# EasyEDA Pro project 嘉立创EDAPRO_A4矮轴_v1.0.0.epro

# Board 20260607开源
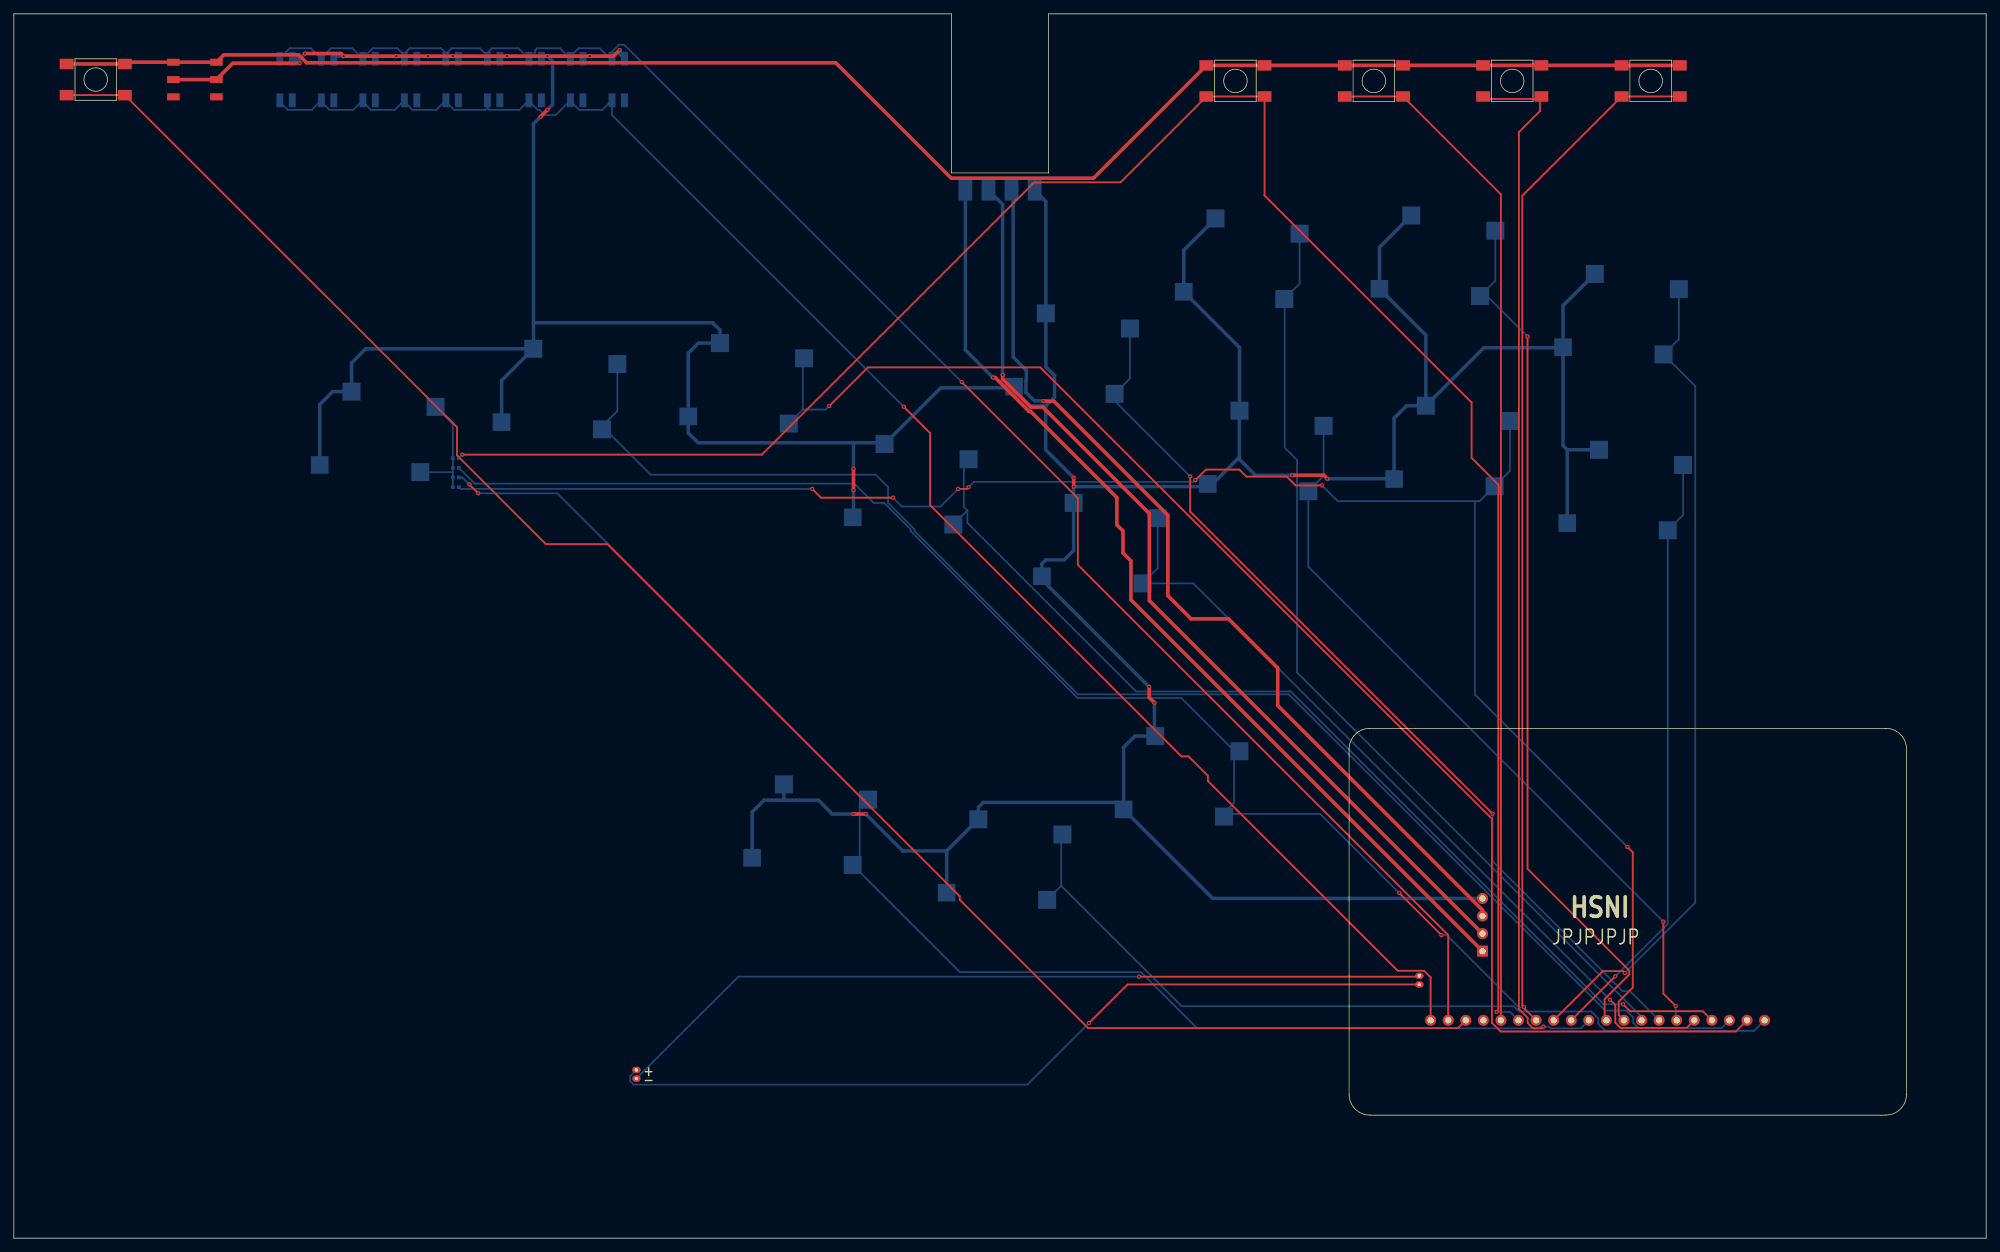
[diagram p0: board, top side]
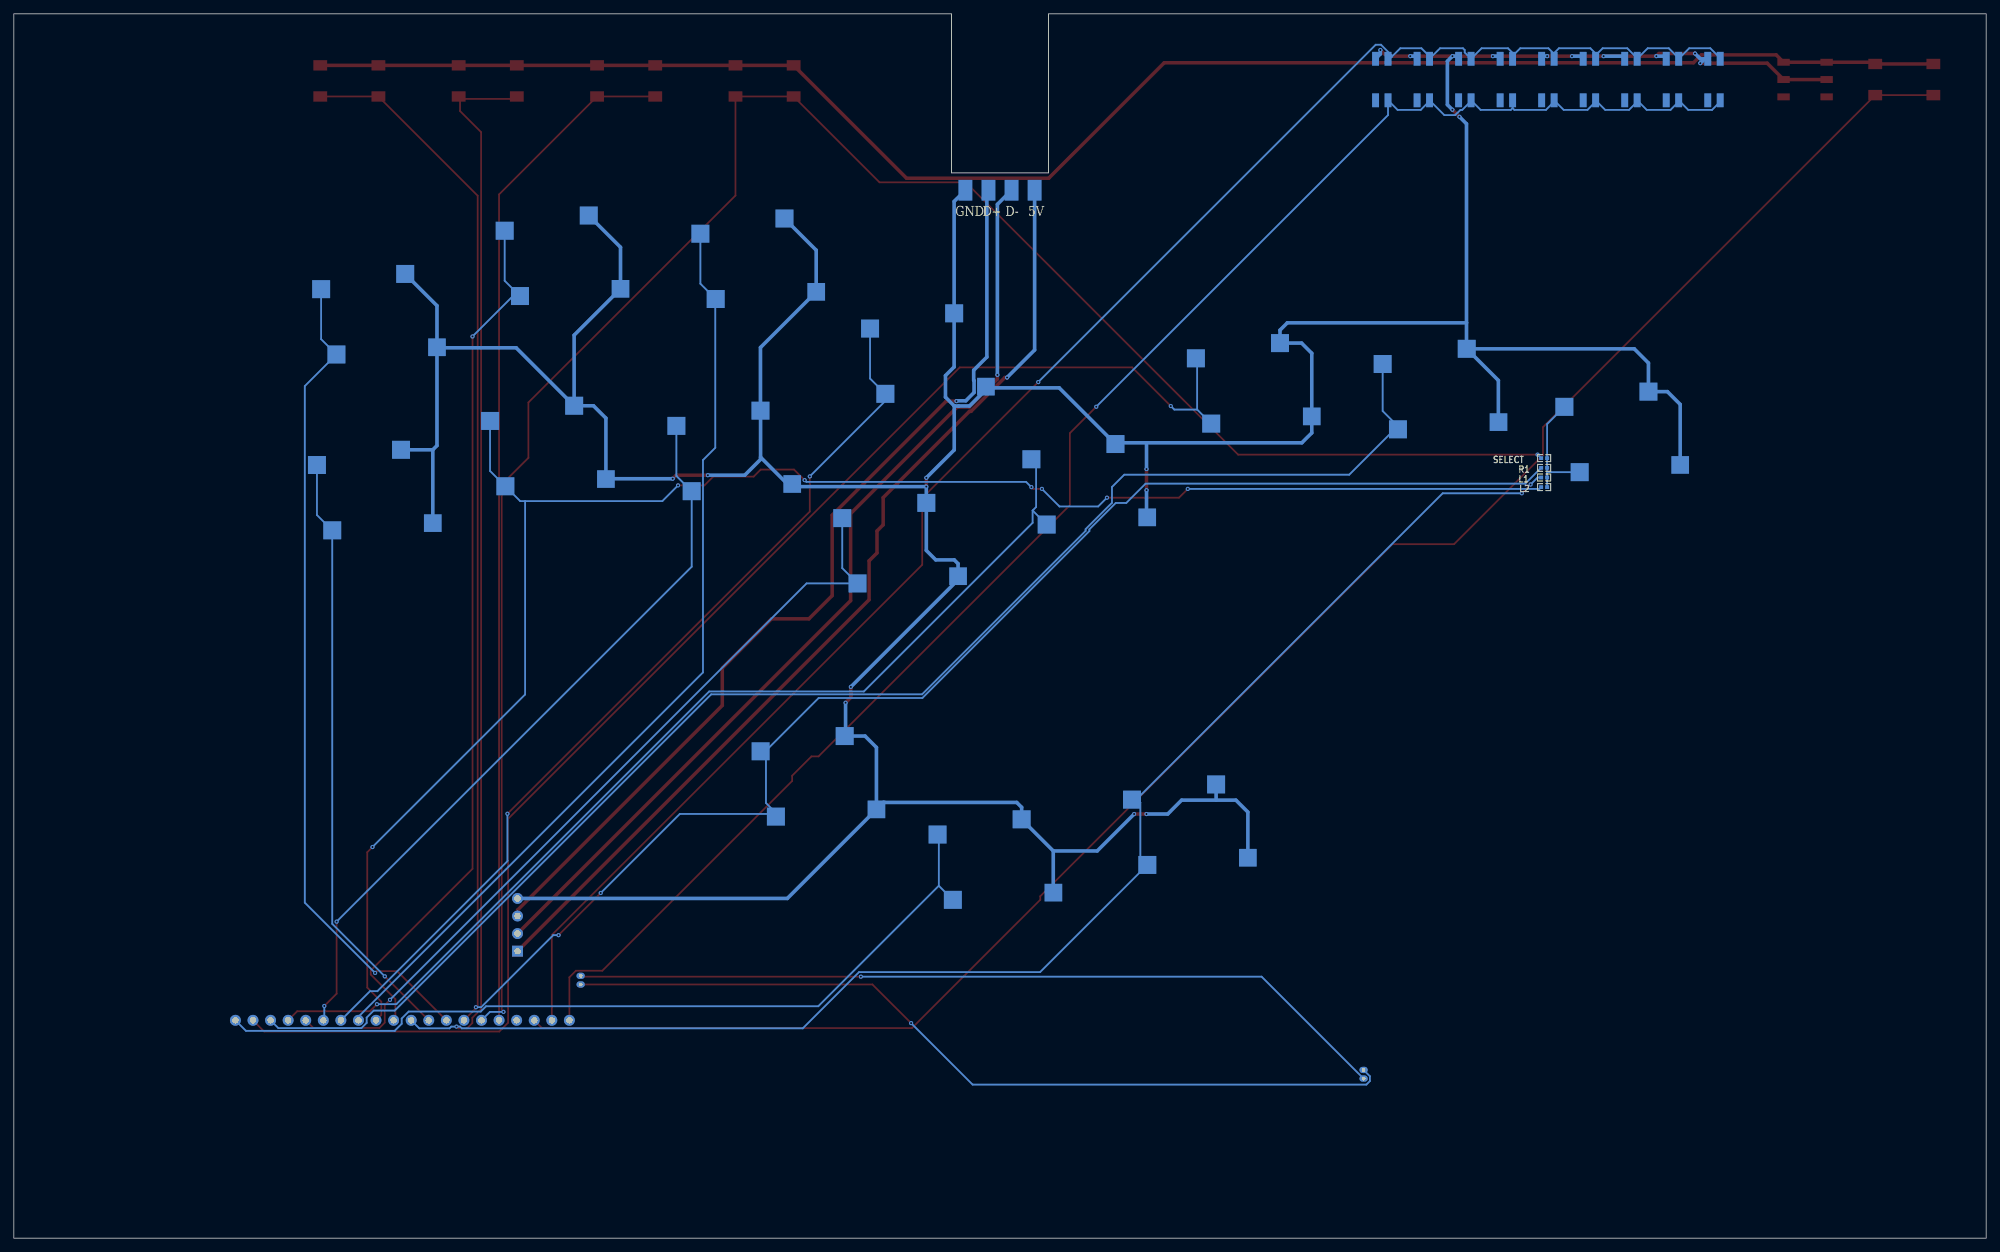
[diagram p1: board, bottom side, seen from below]

Outline 285 x 177 mm; copper layers: Top Layer, Bottom Layer. Coordinates in mm from the lower left corner of the outline.
Outline path: 0,177 135.5,177 135.5,154 149.5,154 149.5,177 285,177 285,0 0,0 0,177
Stack: Top Layer 0.035mm / Dielectric1 1.51mm FR4 er 4.5 / Bottom Layer 0.035mm

## Design rules (mm)
spacing copperThickness1oz (default): track to track 0.102, other pairs 0.152 to 0.3
spacing copperThickness2oz: track to track 0.203, other pairs 0.152 to 0.3
track width copperThickness1oz (default): min 0.127, default 0.254, max 2.54
track width copperThickness2oz: min 0.203, default 0.254, max 2.54
differential pair differentialPair (default): width min 0.127, default 0.254, max 2.54; gap min 0.152, default 0.152

## Placement (name value [footprint] x y rotation side)
L1  10K  [R0402]  63.87 109.97 180 bottom
L2  10K  [R0402]  63.87 108.57 180 bottom
NOREF  -  [Pad_e911]  189.26 117.43 0 top
NOREF#2  -  [Pad_e515]  29.27 167.5 0 top
NOREF#3  -  [Pad_e773]  212.22 46.57 270 top
NOREF#4  -  [Pad_e811]  58.23 164.5 180 top
NOREF#5  -  [Pad_e777]  217.42 31.5 0 top
NOREF#6  -  [Pad_e531]  121.23 104.21 180 top
NOREF#7  -  [Pad_e697]  149.31 48.91 180 top
NOREF#8  -  [Pad_e550]  164.94 72.59 0 top
NOREF#9  -  [Pad_e9]  220.72 165.05 0 top
NOREF#10  -  [Pad_e5]  220.72 169.55 0 top
NOREF#11  -  [Pad_e530]  102.04 129.4 0 top
NOREF#12  -  [Pad_e560]  16.03 165.25 0 top
NOREF#13  -  [Pad_e546]  204.04 120.34 0 top
NOREF#14  -  [Pad_e524]  88.23 170.5 180 top
NOREF#15  -  [Pad_e716]  214.08 145.64 0 top
NOREF#16  -  [Pad_e803]  44.43 170.5 180 top
NOREF#17  -  [Pad_e527]  70.47 117.97 180 top
NOREF#18  -  [Pad_e561]  16.03 169.75 0 top
NOREF#19  -  [Pad_e818]  74.43 170.5 180 top
NOREF#20  -  [Pad_e543]  228.45 139.4 0 top
NOREF#21  -  [Pad_e823]  82.23 164.5 180 top
NOREF#22  -  [Pad_e824]  86.43 170.5 180 top
NOREF#23  -  [Pad_e549]  160.35 61.99 180 top
NOREF#24  -  [Pad_e822]  80.43 170.5 180 top
NOREF#25  -  [Pad_e715]  211.86 136.2 180 top
NOREF#26  -  [Pad_e767]  203.1 37.93 270 top
NOREF#27  -  [Pad_e539]  169.05 136.81 180 top
NOREF#28  -  [Pad_e10]  232.32 165.05 0 top
NOREF#29  -  [Pad_e551]  147.5 151.5 180 top
NOREF#30  -  [Pad_e553]  134.78 49.95 180 top
NOREF#31  -  [Pad_e528]  75.06 128.57 0 top
NOREF#32  -  [Pad_e825]  86.43 164.5 180 top
NOREF#33  -  [Pad_e826]  88.23 164.5 180 top
NOREF#34  -  [Pad_e547]  229.05 113.97 0 top
NOREF#35  -  [Pad_e778]  219.96 31.5 0 top
NOREF#36  -  [Pad_e889]  89.96 24.32 270 top
NOREF#37  -  [Pad_e532]  125.81 114.81 0 top
NOREF#38  -  [Pad_e779]  222.5 31.5 0 top
NOREF#39  -  [Pad_e548]  224.46 103.38 180 top
NOREF#40  -  [Pad_e706]  183.58 135.77 180 top
NOREF#41  -  [Pad_e751]  174.88 60.95 180 top
NOREF#42  -  [Pad_e836]  58.74 110.74 180 top
NOREF#43  -  [Pad_e514]  23.05 167.5 0 top
NOREF#44  -  [Pad_e808]  52.23 164.5 180 top
NOREF#45  -  [Pad_e552]  212.22 49.11 270 top
NOREF#46  -  [Pad_e556]  106.69 55 180 top
NOREF#47  -  [Pad_e901]  163.08 94.66 180 top
NOREF#48  -  [Pad_e542]  201.93 147.84 0 top
NOREF#49  -  [Pad_e791]  252.98 31.5 0 top
NOREF#50  -  [Pad_e800]  38.43 164.5 180 top
NOREF#51  -  [Pad_e813]  62.43 164.5 180 top
NOREF#52  -  [Pad_e814]  64.23 164.5 180 top
NOREF#53  -  [Pad_e819]  74.43 164.5 180 top
NOREF#54  -  [Pad_e789]  247.9 31.5 0 top
NOREF#55  -  [Pad_e809]  56.43 170.5 180 top
NOREF#56  -  [Pad_e892]  159.06 122.06 180 top
NOREF#57  -  [Pad_e520]  64.23 170.5 180 top
NOREF#58  -  [Pad_e563]  7.63 165.25 0 top
NOREF#59  -  [Pad_e8]  212.32 165.05 0 top
NOREF#60  -  [Pad_e544]  223.86 128.8 180 top
NOREF#61  -  [Pad_e798]  29.27 165 0 top
NOREF#62  -  [Pad_e688]  123.43 63.4 0 top
NOREF#63  -  [Pad_e786]  240.28 31.5 0 top
NOREF#64  -  [Pad_e522]  76.23 170.5 180 top
NOREF#65  -  [Pad_e775]  212.34 31.5 0 top
NOREF#66  -  [Pad_e4]  200.72 169.55 0 top
NOREF#67  -  [Pad_e724]  238.39 127.76 180 top
NOREF#68  -  [Pad_e802]  40.23 164.5 180 top
NOREF#69  -  [Pad_e707]  185.79 145.21 0 top
NOREF#70  -  [Pad_e538]  177.11 119.63 0 top
NOREF#71  -  [Pad_e806]  50.43 170.5 180 top
NOREF#72  -  [Pad_e768]  203.1 36.68 270 top
NOREF#73  -  [Pad_e537]  172.52 109.03 180 top
NOREF#74  -  [Pad_e761]  140.83 151.5 180 top
NOREF#75  -  [Pad_e743]  241.2 111.77 0 top
NOREF#76  -  [Pad_e11]  172.32 165.05 0 top
NOREF#77  -  [Pad_e533]  144.54 123.1 180 top
NOREF#78  -  [Pad_e541]  197.34 137.24 180 top
NOREF#79  -  [Pad_e12]  180.72 165.05 0 top
NOREF#80  -  [Pad_e517]  46.23 170.5 180 top
NOREF#81  -  [Pad_e820]  76.23 164.5 180 top
NOREF#82  -  [Pad_e770]  207.26 31.5 0 top
NOREF#83  -  [Pad_e790]  250.44 31.5 0 top
NOREF#84  -  [Pad_e521]  70.23 170.5 180 top
NOREF#85  -  [Pad_e562]  7.63 169.75 0 top
NOREF#86  -  [Pad_e888]  89.96 23.07 270 top
NOREF#87  -  [Pad_e696]  151.52 58.35 0 top
NOREF#88  -  [Pad_e725]  240.6 137.2 0 top
NOREF#89  -  [Pad_e15]  192.32 165.05 0 top
NOREF#90  -  [Pad_e536]  153.15 106.3 0 top
NOREF#91  -  [Pad_e785]  237.74 31.5 0 top
NOREF#92  -  [Pad_e555]  111.28 65.6 0 top
NOREF#93  -  [Pad_e529]  97.45 118.8 180 top
NOREF#94  -  [Pad_e821]  80.43 164.5 180 top
NOREF#95  -  [Pad_e780]  225.04 31.5 0 top
NOREF#96  -  [Pad_e815]  68.43 170.5 180 top
NOREF#97  -  [Pad_e880]  137.97 112.61 0 top
NOREF#98  -  [Pad_e742]  238.99 102.33 180 top
NOREF#99  -  [Pad_e787]  242.82 31.5 0 top
NOREF#100  -  [Pad_e734]  216.19 118.14 0 top
NOREF#101  -  [Pad_e752]  177.09 70.39 0 top
NOREF#102  -  [Pad_e804]  44.43 164.5 180 top
NOREF#103  -  [Pad_e2]  240.72 165.05 0 top
NOREF#104  -  [Pad_e801]  38.43 170.5 180 top
NOREF#105  -  [Pad_e817]  70.23 164.5 180 top
NOREF#106  -  [Pad_e810]  56.43 164.5 180 top
NOREF#107  -  [Pad_e769]  204.72 31.5 0 top
NOREF#108  -  [Pad_e760]  144.17 151.5 180 top
NOREF#109  -  [Pad_e772]  212.22 44.03 270 top
NOREF#110  -  [Pad_e6]  212.32 169.55 0 top
NOREF#111  -  [Pad_e837]  60.95 120.18 0 top
NOREF#112  -  [Pad_e781]  227.58 31.5 0 top
NOREF#113  -  [Pad_e762]  137.5 151.5 180 top
NOREF#114  -  [Pad_e7]  232.32 169.55 0 top
NOREF#115  -  [Pad_e816]  68.43 164.5 180 top
NOREF#116  -  [Pad_e733]  213.97 108.7 180 top
NOREF#117  -  [Pad_e534]  149.12 133.7 0 top
NOREF#118  -  [Pad_e518]  52.23 170.5 180 top
NOREF#119  -  [Pad_e902]  165.3 104.1 0 top
NOREF#120  -  [Pad_e525]  44.21 111.78 180 top
NOREF#121  -  [Pad_e516]  40.23 170.5 180 top
NOREF#122  -  [Pad_e13]  180.72 169.55 0 top
NOREF#123  -  [Pad_e893]  161.27 131.5 0 top
NOREF#124  -  [Pad_e812]  62.43 170.5 180 top
NOREF#125  -  [Pad_e879]  135.75 103.16 180 top
NOREF#126  -  [Pad_e862]  87.21 126.37 0 top
NOREF#127  -  [Pad_e14]  172.32 169.55 0 top
NOREF#128  -  [Pad_e17]  192.32 169.55 0 top
NOREF#129  -  [Pad_e535]  148.56 95.7 180 top
NOREF#130  -  [Pad_e796]  23.05 170 0 top
NOREF#131  -  [Pad_e784]  235.2 31.5 0 top
NOREF#132  -  [Pad_e545]  199.45 109.74 180 top
NOREF#133  -  [Pad_e861]  84.99 116.93 180 top
NOREF#134  -  [Pad_e788]  245.36 31.5 0 top
NOREF#135  -  [Pad_e3]  240.72 169.55 0 top
NOREF#136  -  [Pad_e799]  29.27 170 0 top
NOREF#137  -  [Pad_e705]  187.05 107.99 180 top
NOREF#138  -  [Pad_e783]  232.66 31.5 0 top
NOREF#139  -  [Pad_e782]  230.12 31.5 0 top
NOREF#140  -  [Pad_e687]  121.21 53.96 180 top
NOREF#141  -  [Pad_e519]  58.23 170.5 180 top
NOREF#142  -  [Pad_e526]  48.8 122.38 0 top
NOREF#143  -  [Pad_e774]  212.22 41.49 270 top
NOREF#144  -  [Pad_e16]  200.72 165.05 0 top
NOREF#145  -  [Pad_e870]  111.98 117.76 180 top
NOREF#146  -  [Pad_e540]  173.64 147.41 0 top
NOREF#147  -  [Pad_e771]  209.8 31.5 0 top
NOREF#148  -  [Pad_e797]  23.05 165 0 top
NOREF#149  -  [Pad_e871]  114.19 127.2 0 top
NOREF#150  -  [Pad_e805]  46.23 164.5 180 top
NOREF#151  -  [Pad_e554]  139.37 60.55 0 top
NOREF#152  -  [Pad_e523]  82.23 170.5 180 top
NOREF#153  -  [Pad_e807]  50.43 164.5 180 top
NOREF#154  -  [Pad_e776]  214.88 31.5 0 top
R1  10K  [R0402]  63.87 111.37 180 bottom
SELECT  10K  [R0402]  63.87 112.76 180 bottom

## Footprints (pads in the part's own frame, mm; a bottom-side part is the same pattern mirrored in y, then rotated)
Pad_e2
  rect 2x1.5 smd: (0,0)
Pad_e3
  rect 2x1.5 smd: (0,0)
Pad_e4
  rect 2x1.5 smd: (0,0)
Pad_e5
  rect 2x1.5 smd: (0,0)
Pad_e6
  rect 2x1.5 smd: (0,0)
Pad_e7
  rect 2x1.5 smd: (0,0)
Pad_e8
  rect 2x1.5 smd: (0,0)
Pad_e9
  rect 2x1.5 smd: (0,0)
Pad_e10
  rect 2x1.5 smd: (0,0)
Pad_e11
  rect 2x1.5 smd: (0,0)
Pad_e12
  rect 2x1.5 smd: (0,0)
Pad_e13
  rect 2x1.5 smd: (0,0)
Pad_e14
  rect 2x1.5 smd: (0,0)
Pad_e15
  rect 2x1.5 smd: (0,0)
Pad_e16
  rect 2x1.5 smd: (0,0)
Pad_e17
  rect 2x1.5 smd: (0,0)
Pad_e514
  rect 1.8x1 smd: (0,0)
Pad_e515
  rect 1.8x1 smd: (0,0)
Pad_e516
  rect 1x2 smd far side: (0,0)
Pad_e517
  rect 1x2 smd far side: (0,0)
Pad_e518
  rect 1x2 smd far side: (0,0)
Pad_e519
  rect 1x2 smd far side: (0,0)
Pad_e520
  rect 1x2 smd far side: (0,0)
Pad_e521
  rect 1x2 smd far side: (0,0)
Pad_e522
  rect 1x2 smd far side: (0,0)
Pad_e523
  rect 1x2 smd far side: (0,0)
Pad_e524
  rect 1x2 smd far side: (0,0)
Pad_e525
  rect 2.55x2.55 smd far side: (0,0)
Pad_e526
  rect 2.6x2.6 smd far side: (0,0)
Pad_e527
  rect 2.55x2.55 smd far side: (0,0)
Pad_e528
  rect 2.6x2.6 smd far side: (0,0)
Pad_e529
  rect 2.55x2.55 smd far side: (0,0)
Pad_e530
  rect 2.6x2.6 smd far side: (0,0)
Pad_e531
  rect 2.55x2.55 smd far side: (0,0)
Pad_e532
  rect 2.6x2.6 smd far side: (0,0)
Pad_e533
  rect 2.55x2.55 smd far side: (0,0)
Pad_e534
  rect 2.6x2.6 smd far side: (0,0)
Pad_e535
  rect 2.55x2.55 smd far side: (0,0)
Pad_e536
  rect 2.6x2.6 smd far side: (0,0)
Pad_e537
  rect 2.55x2.55 smd far side: (0,0)
Pad_e538
  rect 2.6x2.6 smd far side: (0,0)
Pad_e539
  rect 2.55x2.55 smd far side: (0,0)
Pad_e540
  rect 2.6x2.6 smd far side: (0,0)
Pad_e541
  rect 2.55x2.55 smd far side: (0,0)
Pad_e542
  rect 2.6x2.6 smd far side: (0,0)
Pad_e543
  rect 2.6x2.6 smd far side: (0,0)
Pad_e544
  rect 2.55x2.55 smd far side: (0,0)
Pad_e545
  rect 2.55x2.55 smd far side: (0,0)
Pad_e546
  rect 2.6x2.6 smd far side: (0,0)
Pad_e547
  rect 2.6x2.6 smd far side: (0,0)
Pad_e548
  rect 2.55x2.55 smd far side: (0,0)
Pad_e549
  rect 2.55x2.55 smd far side: (0,0)
Pad_e550
  rect 2.6x2.6 smd far side: (0,0)
Pad_e551
  rect 2x3 smd far side: (0,0)
Pad_e552
  round 1.575 hole 0.889: (0,0)
Pad_e553
  rect 2.55x2.55 smd far side: (0,0)
Pad_e554
  rect 2.6x2.6 smd far side: (0,0)
Pad_e555
  rect 2.6x2.6 smd far side: (0,0)
Pad_e556
  rect 2.55x2.55 smd far side: (0,0)
Pad_e560
  rect 2x1.5 smd: (0,0)
Pad_e561
  rect 2x1.5 smd: (0,0)
Pad_e562
  rect 2x1.5 smd: (0,0)
Pad_e563
  rect 2x1.5 smd: (0,0)
Pad_e687
  rect 2.6x2.6 smd far side: (0,0)
Pad_e688
  rect 2.6x2.6 smd far side: (0,0)
Pad_e696
  rect 2.6x2.6 smd far side: (0,0)
Pad_e697
  rect 2.6x2.6 smd far side: (0,0)
Pad_e705
  rect 2.6x2.6 smd far side: (0,0)
Pad_e706
  rect 2.6x2.6 smd far side: (0,0)
Pad_e707
  rect 2.6x2.6 smd far side: (0,0)
Pad_e715
  rect 2.6x2.6 smd far side: (0,0)
Pad_e716
  rect 2.6x2.6 smd far side: (0,0)
Pad_e724
  rect 2.6x2.6 smd far side: (0,0)
Pad_e725
  rect 2.6x2.6 smd far side: (0,0)
Pad_e733
  rect 2.6x2.6 smd far side: (0,0)
Pad_e734
  rect 2.6x2.6 smd far side: (0,0)
Pad_e742
  rect 2.6x2.6 smd far side: (0,0)
Pad_e743
  rect 2.6x2.6 smd far side: (0,0)
Pad_e751
  rect 2.6x2.6 smd far side: (0,0)
Pad_e752
  rect 2.6x2.6 smd far side: (0,0)
Pad_e760
  rect 2x3 smd far side: (0,0)
Pad_e761
  rect 2x3 smd far side: (0,0)
Pad_e762
  rect 2x3 smd far side: (0,0)
Pad_e767
  oval 0.9x1.2 hole 0.5: (0,0)
Pad_e768
  oval 0.9x1.2 hole 0.5: (0,0)
Pad_e769
  round 1.575 hole 0.889: (0,0)
Pad_e770
  round 1.575 hole 0.889: (0,0)
Pad_e771
  round 1.575 hole 0.889: (0,0)
Pad_e772
  round 1.575 hole 0.889: (0,0)
Pad_e773
  round 1.575 hole 0.889: (0,0)
Pad_e774
  rect 1.575x1.575 hole 0.889: (0,0)
Pad_e775
  round 1.575 hole 0.889: (0,0)
Pad_e776
  round 1.575 hole 0.889: (0,0)
Pad_e777
  round 1.575 hole 0.889: (0,0)
Pad_e778
  round 1.575 hole 0.889: (0,0)
Pad_e779
  round 1.575 hole 0.889: (0,0)
Pad_e780
  round 1.575 hole 0.889: (0,0)
Pad_e781
  round 1.575 hole 0.889: (0,0)
Pad_e782
  round 1.575 hole 0.889: (0,0)
Pad_e783
  round 1.575 hole 0.889: (0,0)
Pad_e784
  round 1.575 hole 0.889: (0,0)
Pad_e785
  round 1.575 hole 0.889: (0,0)
Pad_e786
  round 1.575 hole 0.889: (0,0)
Pad_e787
  round 1.575 hole 0.889: (0,0)
Pad_e788
  round 1.575 hole 0.889: (0,0)
Pad_e789
  round 1.575 hole 0.889: (0,0)
Pad_e790
  round 1.575 hole 0.889: (0,0)
Pad_e791
  round 1.575 hole 0.889: (0,0)
Pad_e796
  rect 1.8x1 smd: (0,0)
Pad_e797
  rect 1.8x1 smd: (0,0)
Pad_e798
  rect 1.8x1 smd: (0,0)
Pad_e799
  rect 1.8x1 smd: (0,0)
Pad_e800
  rect 1x2 smd far side: (0,0)
Pad_e801
  rect 1x2 smd far side: (0,0)
Pad_e802
  rect 1x2 smd far side: (0,0)
Pad_e803
  rect 1x2 smd far side: (0,0)
Pad_e804
  rect 1x2 smd far side: (0,0)
Pad_e805
  rect 1x2 smd far side: (0,0)
Pad_e806
  rect 1x2 smd far side: (0,0)
Pad_e807
  rect 1x2 smd far side: (0,0)
Pad_e808
  rect 1x2 smd far side: (0,0)
Pad_e809
  rect 1x2 smd far side: (0,0)
Pad_e810
  rect 1x2 smd far side: (0,0)
Pad_e811
  rect 1x2 smd far side: (0,0)
Pad_e812
  rect 1x2 smd far side: (0,0)
Pad_e813
  rect 1x2 smd far side: (0,0)
Pad_e814
  rect 1x2 smd far side: (0,0)
Pad_e815
  rect 1x2 smd far side: (0,0)
Pad_e816
  rect 1x2 smd far side: (0,0)
Pad_e817
  rect 1x2 smd far side: (0,0)
Pad_e818
  rect 1x2 smd far side: (0,0)
Pad_e819
  rect 1x2 smd far side: (0,0)
Pad_e820
  rect 1x2 smd far side: (0,0)
Pad_e821
  rect 1x2 smd far side: (0,0)
Pad_e822
  rect 1x2 smd far side: (0,0)
Pad_e823
  rect 1x2 smd far side: (0,0)
Pad_e824
  rect 1x2 smd far side: (0,0)
Pad_e825
  rect 1x2 smd far side: (0,0)
Pad_e826
  rect 1x2 smd far side: (0,0)
Pad_e836
  rect 2.6x2.6 smd far side: (0,0)
Pad_e837
  rect 2.6x2.6 smd far side: (0,0)
Pad_e861
  rect 2.6x2.6 smd far side: (0,0)
Pad_e862
  rect 2.6x2.6 smd far side: (0,0)
Pad_e870
  rect 2.6x2.6 smd far side: (0,0)
Pad_e871
  rect 2.6x2.6 smd far side: (0,0)
Pad_e879
  rect 2.6x2.6 smd far side: (0,0)
Pad_e880
  rect 2.6x2.6 smd far side: (0,0)
Pad_e888
  oval 0.9x1.2 hole 0.5: (0,0)
Pad_e889
  oval 0.9x1.2 hole 0.5: (0,0)
Pad_e892
  rect 2.6x2.6 smd far side: (0,0)
Pad_e893
  rect 2.6x2.6 smd far side: (0,0)
Pad_e901
  rect 2.6x2.6 smd far side: (0,0)
Pad_e902
  rect 2.6x2.6 smd far side: (0,0)
Pad_e911
  rect 2.6x2.6 smd far side: (0,0)
R0402
  rect 0.566x0.54 smd: 1(-0.433,0) 2(0.433,0)

## Nets
GND: NOREF#2. NOREF#6. NOREF#8. NOREF#11. NOREF#13. NOREF#14. NOREF#17. NOREF#20. NOREF#23. NOREF#27. NOREF#29. NOREF#30. NOREF#31. NOREF#34. NOREF#37. NOREF#39. NOREF#43. NOREF#45. NOREF#46. NOREF#48. NOREF#57. NOREF#60. NOREF#64. NOREF#70. NOREF#73. NOREF#77. NOREF#78. NOREF#80. NOREF#84. NOREF#90. NOREF#92. NOREF#93. NOREF#117. NOREF#118. NOREF#120. NOREF#121. NOREF#129. NOREF#132. NOREF#141. NOREF#142. NOREF#146. NOREF#151. NOREF#152.
GND1: NOREF#10. NOREF#18. NOREF#66. NOREF#85. NOREF#110. NOREF#114. NOREF#122. NOREF#127. NOREF#128. NOREF#130. NOREF#135. NOREF#136.
VCC: NOREF#32. NOREF#50. NOREF#51. NOREF#53. NOREF#94. NOREF#102. NOREF#106. NOREF#107. NOREF#115. NOREF#153.
+: NOREF#113. NOREF#143.
A: NOREF#47. NOREF#99. NOREF#119.
ADD: L1.2 L2.2 NOREF#42. NOREF#111. R1.2 SELECT.2
B: NOREF. NOREF#63. NOREF#137.
D+: NOREF#3. NOREF#108.
D-: NOREF#74. NOREF#109.
DIN: NOREF#16. NOREF#19. NOREF#22. NOREF#24. NOREF#55. NOREF#71. NOREF#82. NOREF#96. NOREF#104. NOREF#124.
DOWN: NOREF#83. NOREF#145. NOREF#149.
HOME: NOREF#12. NOREF#58. NOREF#147.
L1: L2.1 NOREF#100. NOREF#116. NOREF#138.
L2: NOREF#15. NOREF#25. NOREF#139.
L3: L1.1 NOREF#9. NOREF#59. NOREF#62. NOREF#112. NOREF#140.
LEFT: NOREF#54. NOREF#126. NOREF#133.
R1: NOREF#75. NOREF#95. NOREF#98.
R2: NOREF#38. NOREF#67. NOREF#88.
R3: NOREF#28. NOREF#35. NOREF#41. NOREF#101. NOREF#103. R1.1
RIGHT: NOREF#97. NOREF#125. NOREF#134.
SELECT: NOREF#5. NOREF#76. NOREF#79. SELECT.1
START: NOREF#89. NOREF#144. NOREF#154.
UP: NOREF#7. NOREF#49. NOREF#87.
W+: NOREF#36. NOREF#72.
W-: NOREF#26. NOREF#86.
X: NOREF#56. NOREF#91. NOREF#123.
Y: NOREF#40. NOREF#69. NOREF#131.

## Via types
v1: diameter 0.61, hole 0.305, Top Layer to Bottom Layer, 54 vias

## Routing (per net, layer and track width the routed paths; a pad name or vN(x,y) marks a point on that pad's centre or on a via; arc(x,y) is an arc through that point)
GND: length 738.7
  Top Layer w0.508: 23.05,167.5 29.27,167.5 31.64,169.87 v1(41.31,169.87) ; v1(164.05,79.7) 164.05,78.17 v1(164.81,77.41) ; v1(121.33,111.18) v1(121.33,108.13) ; v1(123.12,61.31) v1(121.34,61.31) ; v1(77.12,163.13) v1(76.11,162.12) ; v1(153.15,109.92) v1(153.15,108.65) ; v1(184.72,110.3) 189.29,110.3 v1(189.8,109.79) ; v1(87.54,171.77) 86.65,170.88 v1(83.22,170.88) v1(77.12,170.88) v1(71.28,170.88) v1(63.44,170.88) v1(59.85,170.88) v1(55.28,170.88) v1(47.66,170.88) 47.28,171.26 v1(42.07,171.26)
  Bottom Layer w0.508: 149.11,120.31 150.38,121.58 150.38,124.7 149.12,125.96 149.12,149.88 147.5,151.5 ; 149.11,120.31 149.11,113.96 v1(153.15,109.92) ; 149.11,120.31 149.09,120.31 149.08,120.3 148.49,120.3 148.48,120.31 146.9,120.31 144.54,122.67 144.54,123.1 144.37,122.93 133.94,122.93 125.81,114.81 125.63,114.99 121.33,114.99 ; 75.09,132.33 75.09,161.1 v1(76.11,162.12) ; 75.09,132.33 75.09,128.61 ; 75.09,132.33 100.98,132.33 102.04,131.27 102.04,129.4 98.92,129.4 97.45,127.93 97.45,116.42 98.88,114.99 121.33,114.99 ; 223.86,128.8 223.86,114.58 224.46,113.97 ; 223.86,128.8 223.79,128.73 212.42,128.73 204.04,120.34 ; 223.86,128.8 223.86,134.81 228.45,139.4 ; v1(184.72,110.3) 179.39,110.3 177.1,112.59 177.1,112.9 ; 40.67,170.5 41.31,170.5 v1(42.07,171.26) ; 40.67,170.5 40.23,170.5 ; 40.67,170.5 v1(41.31,169.87) ; 134.78,49.95 134.8,49.97 134.8,55.98 ; 88.23,170.5 87.54,171.19 v1(87.54,171.77) ; 204.04,120.34 201.24,120.34 199.45,118.55 199.45,109.74 199.4,109.79 v1(189.8,109.79) ; 204.04,120.34 204.04,130.55 197.34,137.24 197.34,143.25 201.93,147.84 ; 82.23,170.5 82.61,170.88 v1(83.22,170.88) ; v1(77.12,163.13) 77.85,163.86 77.85,170.15 v1(77.12,170.88) 76.61,170.88 76.23,170.5 ; 160.35,61.99 160.35,70.95 162,72.59 164.94,72.59 164.81,72.72 v1(164.81,77.41) ; 160.35,61.99 173.23,49.11 212.22,49.11 ; 160.35,61.99 159.35,62.99 140.08,62.99 139.37,62.28 139.37,60.55 134.8,55.98 ; v1(47.66,170.88) 46.61,170.88 46.23,170.5 ; 121.33,114.99 v1(121.33,111.18) ; 173.64,147.41 169.05,142.82 169.05,136.81 177.11,128.76 177.11,119.63 177.1,119.61 177.1,112.9 ; 70.47,117.97 70.48,117.99 70.48,124 75.06,128.57 50.85,128.57 48.8,126.52 48.8,122.38 46.06,122.38 44.21,120.54 44.21,111.78 ; 229.05,113.97 224.46,113.97 ; 224.46,113.97 224.46,103.38 ; 111.27,63.32 111.28,65.6 ; 111.27,63.32 108.41,63.32 106.69,61.6 106.69,55 ; 111.27,63.32 116.26,63.32 118.26,61.31 v1(121.34,61.31) ; 58.23,170.5 58.61,170.88 v1(59.85,170.88) ; 177.1,112.9 173.22,109.03 172.52,109.03 172.15,108.65 v1(153.15,108.65) 153.15,99.42 151.78,98.06 149.11,98.06 148.56,97.5 148.56,95.19 v1(164.05,79.7) ; v1(123.12,61.31) 128.45,55.98 134.8,55.98 ; v1(63.44,170.88) 63.85,170.88 64.23,170.5 ; 70.23,170.5 70.61,170.88 v1(71.28,170.88) ; v1(121.33,108.13) 121.33,104.31 121.23,104.21 ; v1(55.28,170.88) 52.61,170.88 52.23,170.5
GND1: length 247.8
  Top Layer w0.508: 240.72,169.55 172.32,169.55 156,153.24 135.46,153.24 118.77,169.93 42.29,169.93 41.15,171.07 30.34,171.07 29.27,170 16.28,170 16.03,169.75 7.63,169.75
VCC: length 243.5
  Top Layer w0.254: 204.72,31.5 204.72,37.71 203.78,38.66 199.97,38.66 172.54,66.09 172.54,66.85 169.74,69.65 168.73,69.65 132.41,105.97 132.41,116.38 v1(128.59,120.19)
  Bottom Layer w0.254: 68.43,163.37 68.69,163.12 73.05,163.12 74.43,164.5 74.43,164.39 75.7,163.12 75.95,163.12 76.72,162.36 78.29,162.36 80.43,164.5 80.43,164.39 81.7,163.12 85.05,163.12 86.43,164.5 86.43,162.36 v1(128.59,120.19) ; 68.43,163.37 68.18,163.12 63.61,163.12 62.43,164.29 62.43,164.5 61.05,163.12 57.61,163.12 56.43,164.29 56.43,164.5 55.05,163.12 51.6,163.12 50.43,164.29 50.43,164.5 49.05,163.12 45.6,163.12 44.43,164.29 44.43,164.5 43.05,163.12 39.6,163.12 38.43,164.29 38.43,164.5 ; 68.43,163.37 68.43,164.5
+: length 141.3
  Top Layer w0.508: 212.22,41.49 161.42,92.29 161.42,97.92 160.27,99.06 160.27,102.23 159.38,103.12 159.38,107.06 146.91,119.53 146.69,119.53 141.79,124.42 v1(141.48,124.42)
  Bottom Layer w0.508: v1(141.48,124.42) 137.5,128.4 137.5,151.5
A: length 118.7
  Top Layer w0.254: 242.82,31.5 241.72,30.39 232.17,30.39 231.41,31.16 231.41,33.7 v1(230.65,34.46)
  Bottom Layer w0.254: v1(230.65,34.46) 170.45,94.66 163.08,94.66 165.3,96.87 165.3,104.1
ADD: length 17.3
  Bottom Layer w0.254: 58.74,110.74 58.75,110.73 63.44,110.73 ; L2.2 L1.2 63.44,110.73 ; 63.44,110.73 R1.2 SELECT.2 63.44,117.69 60.95,120.18
B: length 108.9
  Top Layer w0.254: v1(240.14,33.57) 238.36,35.34 v1(238.36,45.76)
  Bottom Layer w0.254: 240.28,31.5 240.14,31.64 v1(240.14,33.57) ; v1(238.36,45.76) 187.05,97.07 187.05,107.99 189.26,110.2 189.26,117.43
D+: length 138
  Top Layer w0.508: v1(148.78,121.01) 150.26,121.01 166.75,104.52 166.75,92.89 170.1,89.54 175.51,89.54 182.63,82.42 182.63,77.02 212.22,47.42 212.22,46.57
  Bottom Layer w0.508: v1(148.78,121.01) 148.73,121.06 147.44,121.06 146.25,122.26 146.25,123.96 146.3,124.02 146.3,125.48 144.4,127.38 144.4,151.27 144.17,151.5
D-: length 138.1
  Top Layer w0.508: v1(142.88,124.8) 142.88,124.21 146.94,120.14 148.69,120.14 164.08,104.75 164.08,92.17 212.22,44.03
  Bottom Layer w0.508: 140.83,151.5 142.88,149.46 v1(142.88,124.8)
DIN: length 252.9
  Top Layer w0.254: 207.26,31.5 207.26,43.82 153.74,97.35 153.74,107 v1(136.98,123.76)
  Bottom Layer w0.254: 86.43,170.5 86.18,170.5 85.92,170.75 ; 68.33,171.01 68.33,171.26 69.1,172.02 72.91,172.02 74.43,170.5 75.35,171.42 75.35,171.77 75.61,172.02 78.91,172.02 80.43,170.5 80.43,170.85 81.61,172.02 84.65,172.02 85.92,170.75 ; 68.33,171.01 68.33,170.6 68.43,170.5 ; 68.33,171.01 67.32,172.02 63.25,172.02 62.49,171.26 ; 56.43,171.01 55.42,172.02 51.86,172.02 50.43,170.6 50.43,170.5 48.91,172.02 45.86,172.02 44.43,170.6 44.43,170.5 42.91,172.02 39.86,172.02 38.43,170.6 38.43,170.5 ; 56.43,171.01 56.43,171.26 57.19,172.02 61.73,172.02 62.49,171.26 ; 56.43,171.01 56.43,170.5 ; v1(136.98,123.76) 88.21,172.53 87.45,172.53 85.92,171.01 85.92,170.75 ; 62.43,170.5 62.49,170.56 62.49,171.26
DOWN: length 207
  Top Layer w0.254: v1(117.82,120.3) 123.41,125.89 148.32,125.89 213.58,60.62 213.58,31.15 214.85,29.88 248.82,29.88 250.44,31.5
  Bottom Layer w0.254: 111.98,117.76 114.01,119.79 ; 114.01,119.79 114.01,127.02 114.19,127.2 ; 114.01,119.79 117.31,119.79 v1(117.82,120.3)
HOME: length 261.2
  Top Layer w0.254: 7.63,165.25 16.03,165.25 64.04,117.24 64.04,113.18 76.89,100.33 85.78,100.33 136.68,49.43 136.68,48.92 155.22,30.38 208.68,30.38 209.8,31.5
L1: length 251.8
  Top Layer w0.254: v1(136.44,108.32) 137.71,108.32 v1(137.97,108.57) ; 232.66,31.5 231.9,32.26 231.9,34.2 233.93,36.23 233.93,55.79 v1(233.17,56.55) ; v1(189.02,108.83) 185.21,108.83 183.94,110.1 178.1,110.1 177.08,111.11 172.26,111.11 v1(170.73,109.59) ; v1(115.36,108.32) 116.63,107.05 v1(127.04,107.05)
  Bottom Layer w0.254: 211.12,106.55 211.12,78.6 v1(233.17,56.55) ; 211.12,106.55 211.82,106.55 213.97,108.7 216.19,110.91 216.19,118.14 ; 211.12,106.55 191.29,106.55 v1(189.02,108.83) ; v1(137.97,108.57) 138.73,109.34 170.48,109.34 v1(170.73,109.59) ; v1(127.04,107.05) 128.31,105.78 133.9,105.78 v1(136.44,108.32) ; v1(115.36,108.32) 64.56,108.32 L2.1
L2: length 126.2
  Top Layer w0.254: v1(218.72,130.36) 218.72,53.4 233.43,38.69 233.43,38.11 229.87,34.56 229.87,31.75 230.12,31.5
  Bottom Layer w0.254: v1(218.72,130.36) 212.88,136.2 211.86,136.2 214.08,138.41 214.08,145.64
L3: length 352.3
  Top Layer w0.254: 212.32,165.05 212.67,164.7 220.53,164.7 ; 220.72,165.05 220.53,164.86 220.53,164.7 ; v1(221.04,30.59) 220.78,30.33 219.51,30.33 218.75,31.1 218.75,31.86 217.48,33.13 217.48,159.9 220.53,162.95 220.53,164.7 ; v1(65.83,108.95) v1(67.1,107.68)
  Bottom Layer w0.254: 123.43,63.4 123.33,63.49 122.73,63.49 ; 122.73,63.49 122.22,62.98 122.22,54.96 121.21,53.96 136.71,38.46 162.87,38.46 171,30.33 220.27,30.33 220.53,30.59 v1(221.04,30.59) 221.8,30.59 222.05,30.33 226.42,30.33 227.58,31.5 ; 122.73,63.49 78.53,107.68 v1(67.1,107.68) ; v1(65.83,108.95) 64.81,109.97 L1.1
LEFT: length 211.5
  Bottom Layer w0.254: 87.21,126.37 87.21,119.58 85.17,117.55 85.17,117.23 ; 85.17,117.23 85.17,117.11 84.99,116.93 ; 85.17,117.23 92.03,110.37 124.54,110.37 126.32,108.59 126.32,106.31 130.13,102.5 130.13,102.24 153.75,78.62 184.23,78.62 229.95,32.9 233,32.9 234.02,31.89 234.02,31.12 234.78,30.36 246.77,30.36 247.9,31.5
R1: length 87
  Top Layer w0.254: 225.04,31.5 v1(231.39,37.85)
  Bottom Layer w0.254: 241.2,111.77 241.2,104.54 238.99,102.33 238.99,45.44 v1(231.39,37.85)
R2: length 119.2
  Top Layer w0.254: 222.5,31.5 229.61,38.6 232.54,38.6 v1(232.8,38.35)
  Bottom Layer w0.254: 240.6,137.2 240.6,129.97 238.39,127.76 242.96,123.18 242.96,48.51 v1(232.8,38.35)
R3: length 343.5
  Top Layer w0.254: 240.72,165.05 232.32,165.05 217.98,150.71 217.98,33.64 v1(218.23,33.39) 218.23,33.23 219.96,31.5 ; v1(200.2,49.9) v1(206.29,43.8)
  Bottom Layer w0.254: 175.05,61.33 188.77,61.33 v1(200.2,49.9) ; 175.05,61.33 174.88,60.95 ; 175.05,61.33 175.05,61.65 176.32,62.92 176.32,70.47 ; v1(218.23,33.39) 217.47,33.39 207.05,43.8 v1(206.29,43.8) ; 177.09,70.39 177.01,70.47 176.32,70.47 ; 176.32,70.47 168.7,78.09 153.71,78.09 129.58,102.22 129.58,102.48 125.77,106.29 124.25,106.29 121.46,109.08 66.59,109.08 R1.1
RIGHT: length 149.9
  Top Layer w0.254: 245.36,31.5 244.05,32.81 233.54,32.81 v1(232.53,33.82)
  Bottom Layer w0.254: 135.75,103.16 137.79,105.2 ; 137.79,105.2 137.79,103.42 162.17,79.03 184.52,79.03 229.73,33.82 v1(232.53,33.82) ; 137.79,105.2 137.28,105.7 137.28,111.92 137.97,112.61
SELECT: length 288.2
  Top Layer w0.254: v1(64.81,113.27) 108.08,113.27 147.45,152.64 159.91,152.64 172.32,165.05 180.72,165.05 180.72,150.73 210.64,120.81 210.64,112.81 214.51,108.95 214.51,32.97 v1(214.25,32.72)
  Bottom Layer w0.254: SELECT.1 v1(64.81,113.27) ; v1(214.25,32.72) 216.2,32.72 217.42,31.5
START: length 147.8
  Top Layer w0.254: 192.32,165.05 200.72,165.05 214.88,150.89 214.88,31.5
UP: length 121.8
  Bottom Layer w0.254: 151.52,58.35 151.34,58.17 151.34,50.94 ; 151.34,50.94 168.76,33.53 216.76,33.53 217.53,32.77 227.94,32.77 228.96,31.75 228.96,30.99 229.97,29.97 251.46,29.97 252.98,31.5 ; 151.34,50.94 149.31,48.91
W+: length 122.2
  Top Layer w0.254: 203.1,36.68 160.93,36.68 v1(155.35,31.09)
  Bottom Layer w0.254: v1(155.35,31.09) 146.46,22.2 89.56,22.2 89.05,22.71 89.05,23.41 89.96,24.32
W-: length 119.3
  Top Layer w0.254: 203.1,37.93 202.97,37.8 v1(162.61,37.8)
  Bottom Layer w0.254: v1(162.61,37.8) 104.69,37.8 89.96,23.07
X: length 134.1
  Top Layer w0.254: v1(169.99,110.12) 169.99,105.04 v1(213.67,61.36)
  Bottom Layer w0.254: 237.74,31.5 233.54,35.7 232.47,35.7 213.67,54.5 v1(213.67,61.36) ; v1(169.99,110.12) 159.06,121.05 159.06,122.06 161.27,124.27 161.27,131.5
Y: length 136
  Bottom Layer w0.254: 235.2,31.5 235.2,32 185.42,81.79 185.42,112.49 183.64,114.27 183.64,135.71 183.58,135.77 185.79,137.98 185.79,145.21

## Text on the board
Bottom Silkscreen Layer: 5V | D- | D+ | GND
Top Silkscreen Layer: + | - | JPJPJPJP | HSNI
